# EAGLE schematic moire_v1.2 (EAGLE 9.2.0)

## Sheet 1 of 2
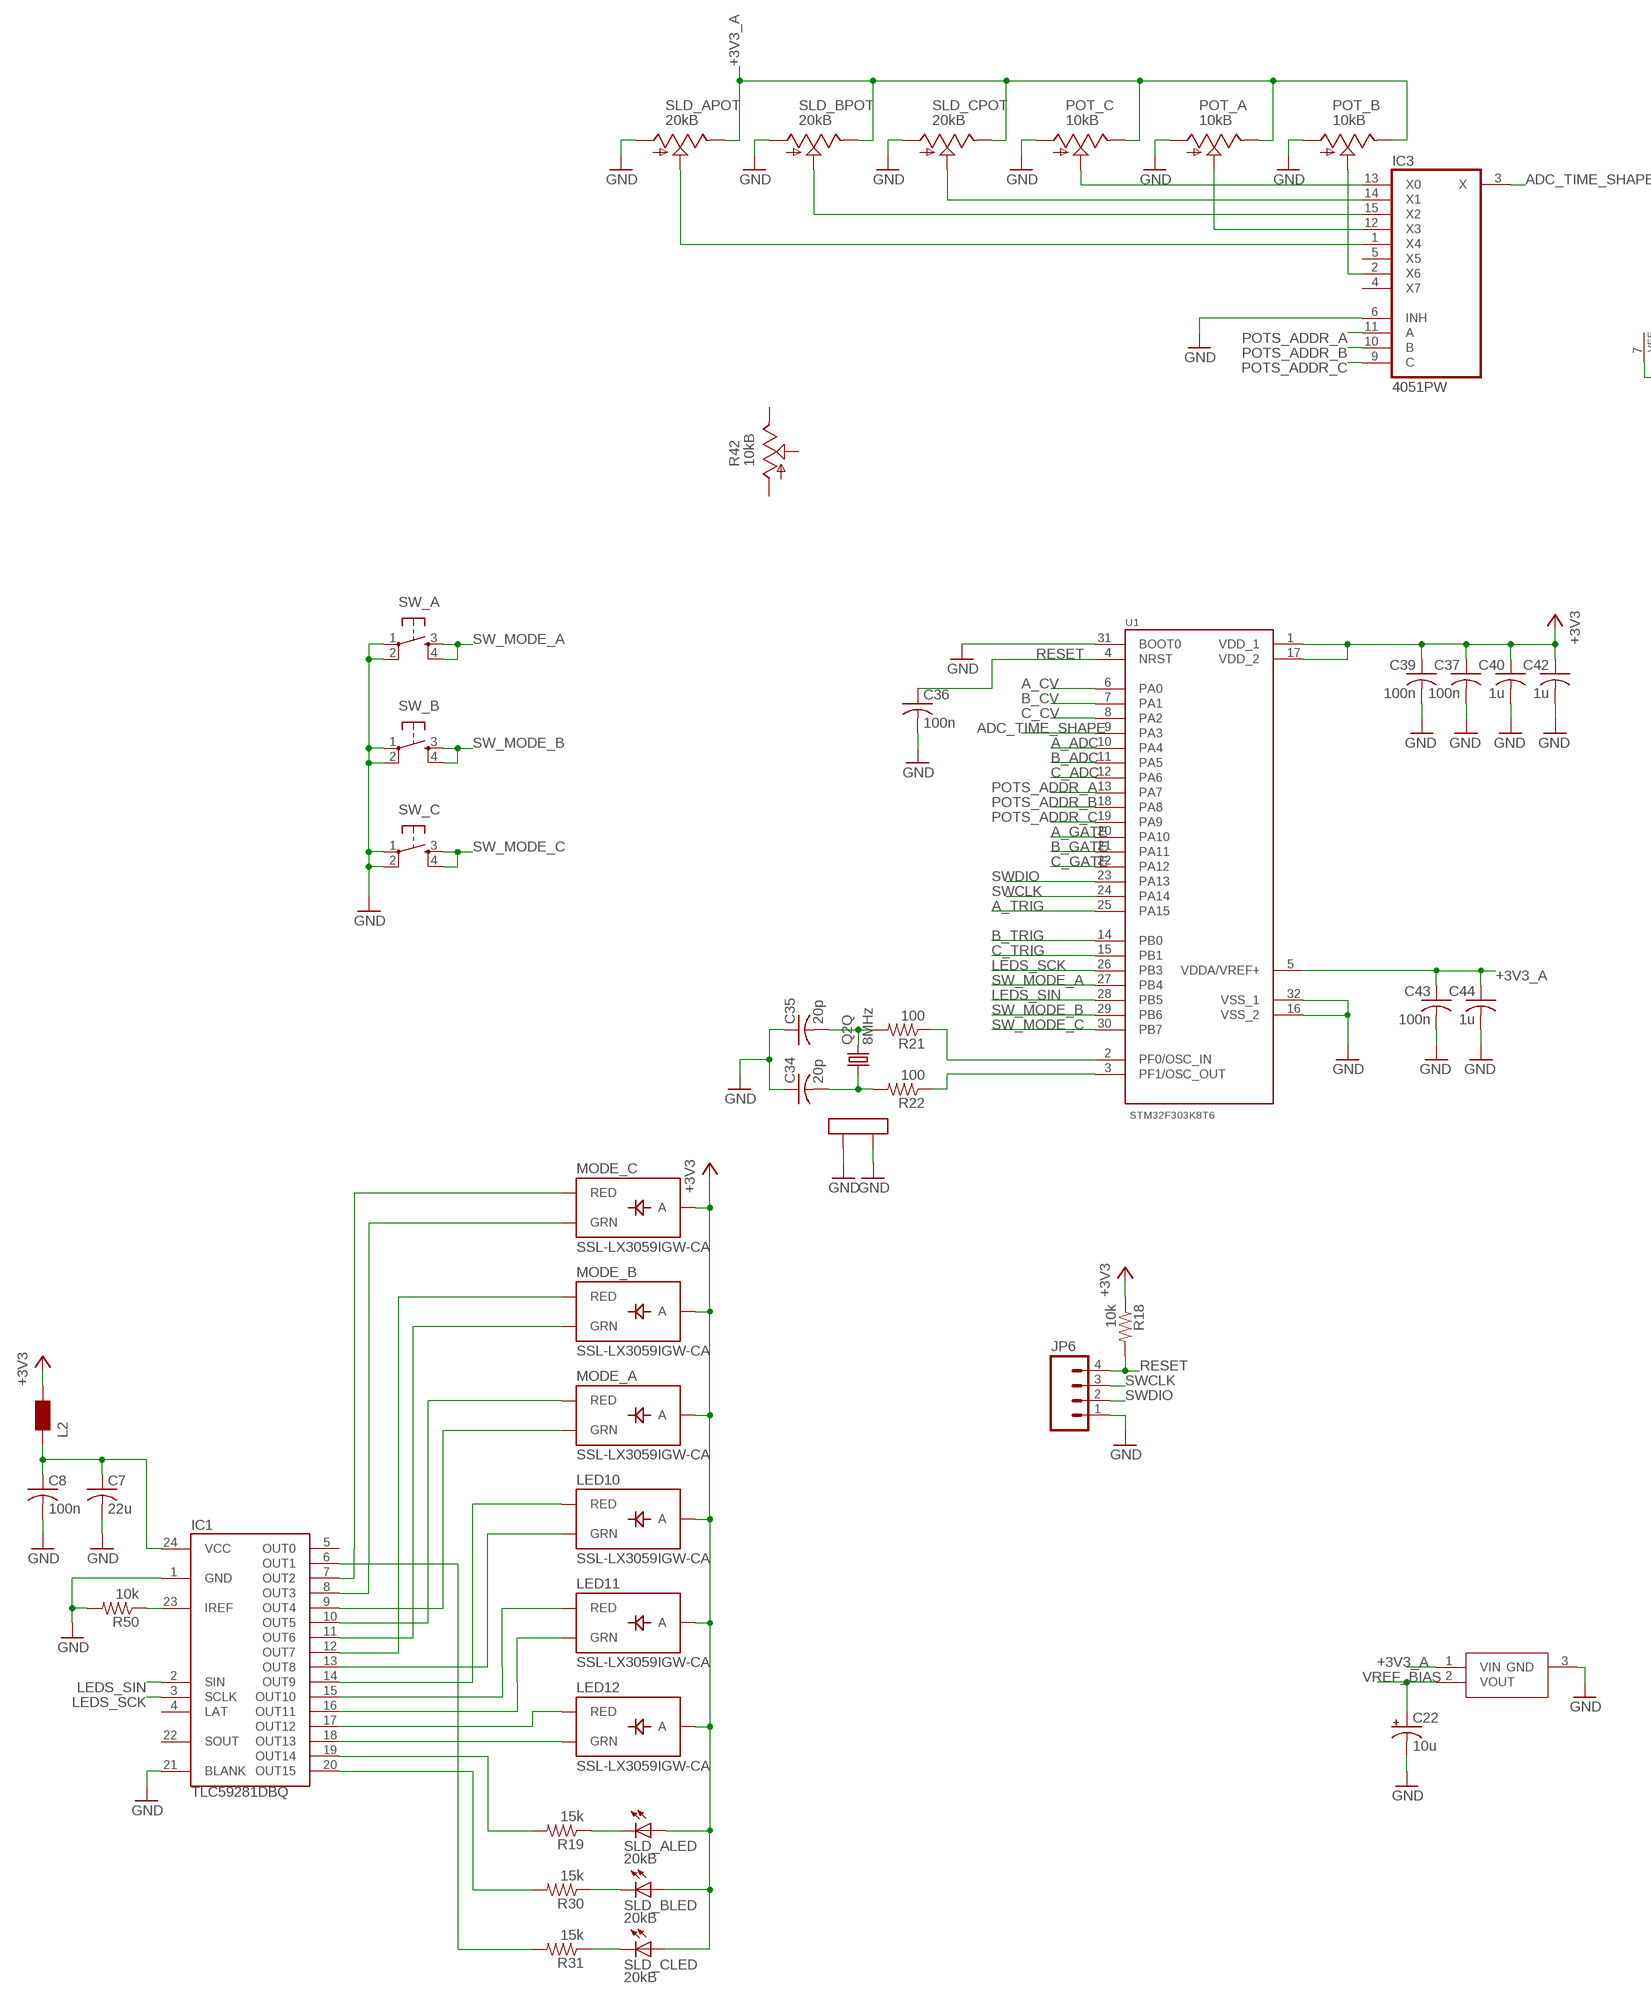
[diagram p0: schematic, sheet 1, part 1 of 2]
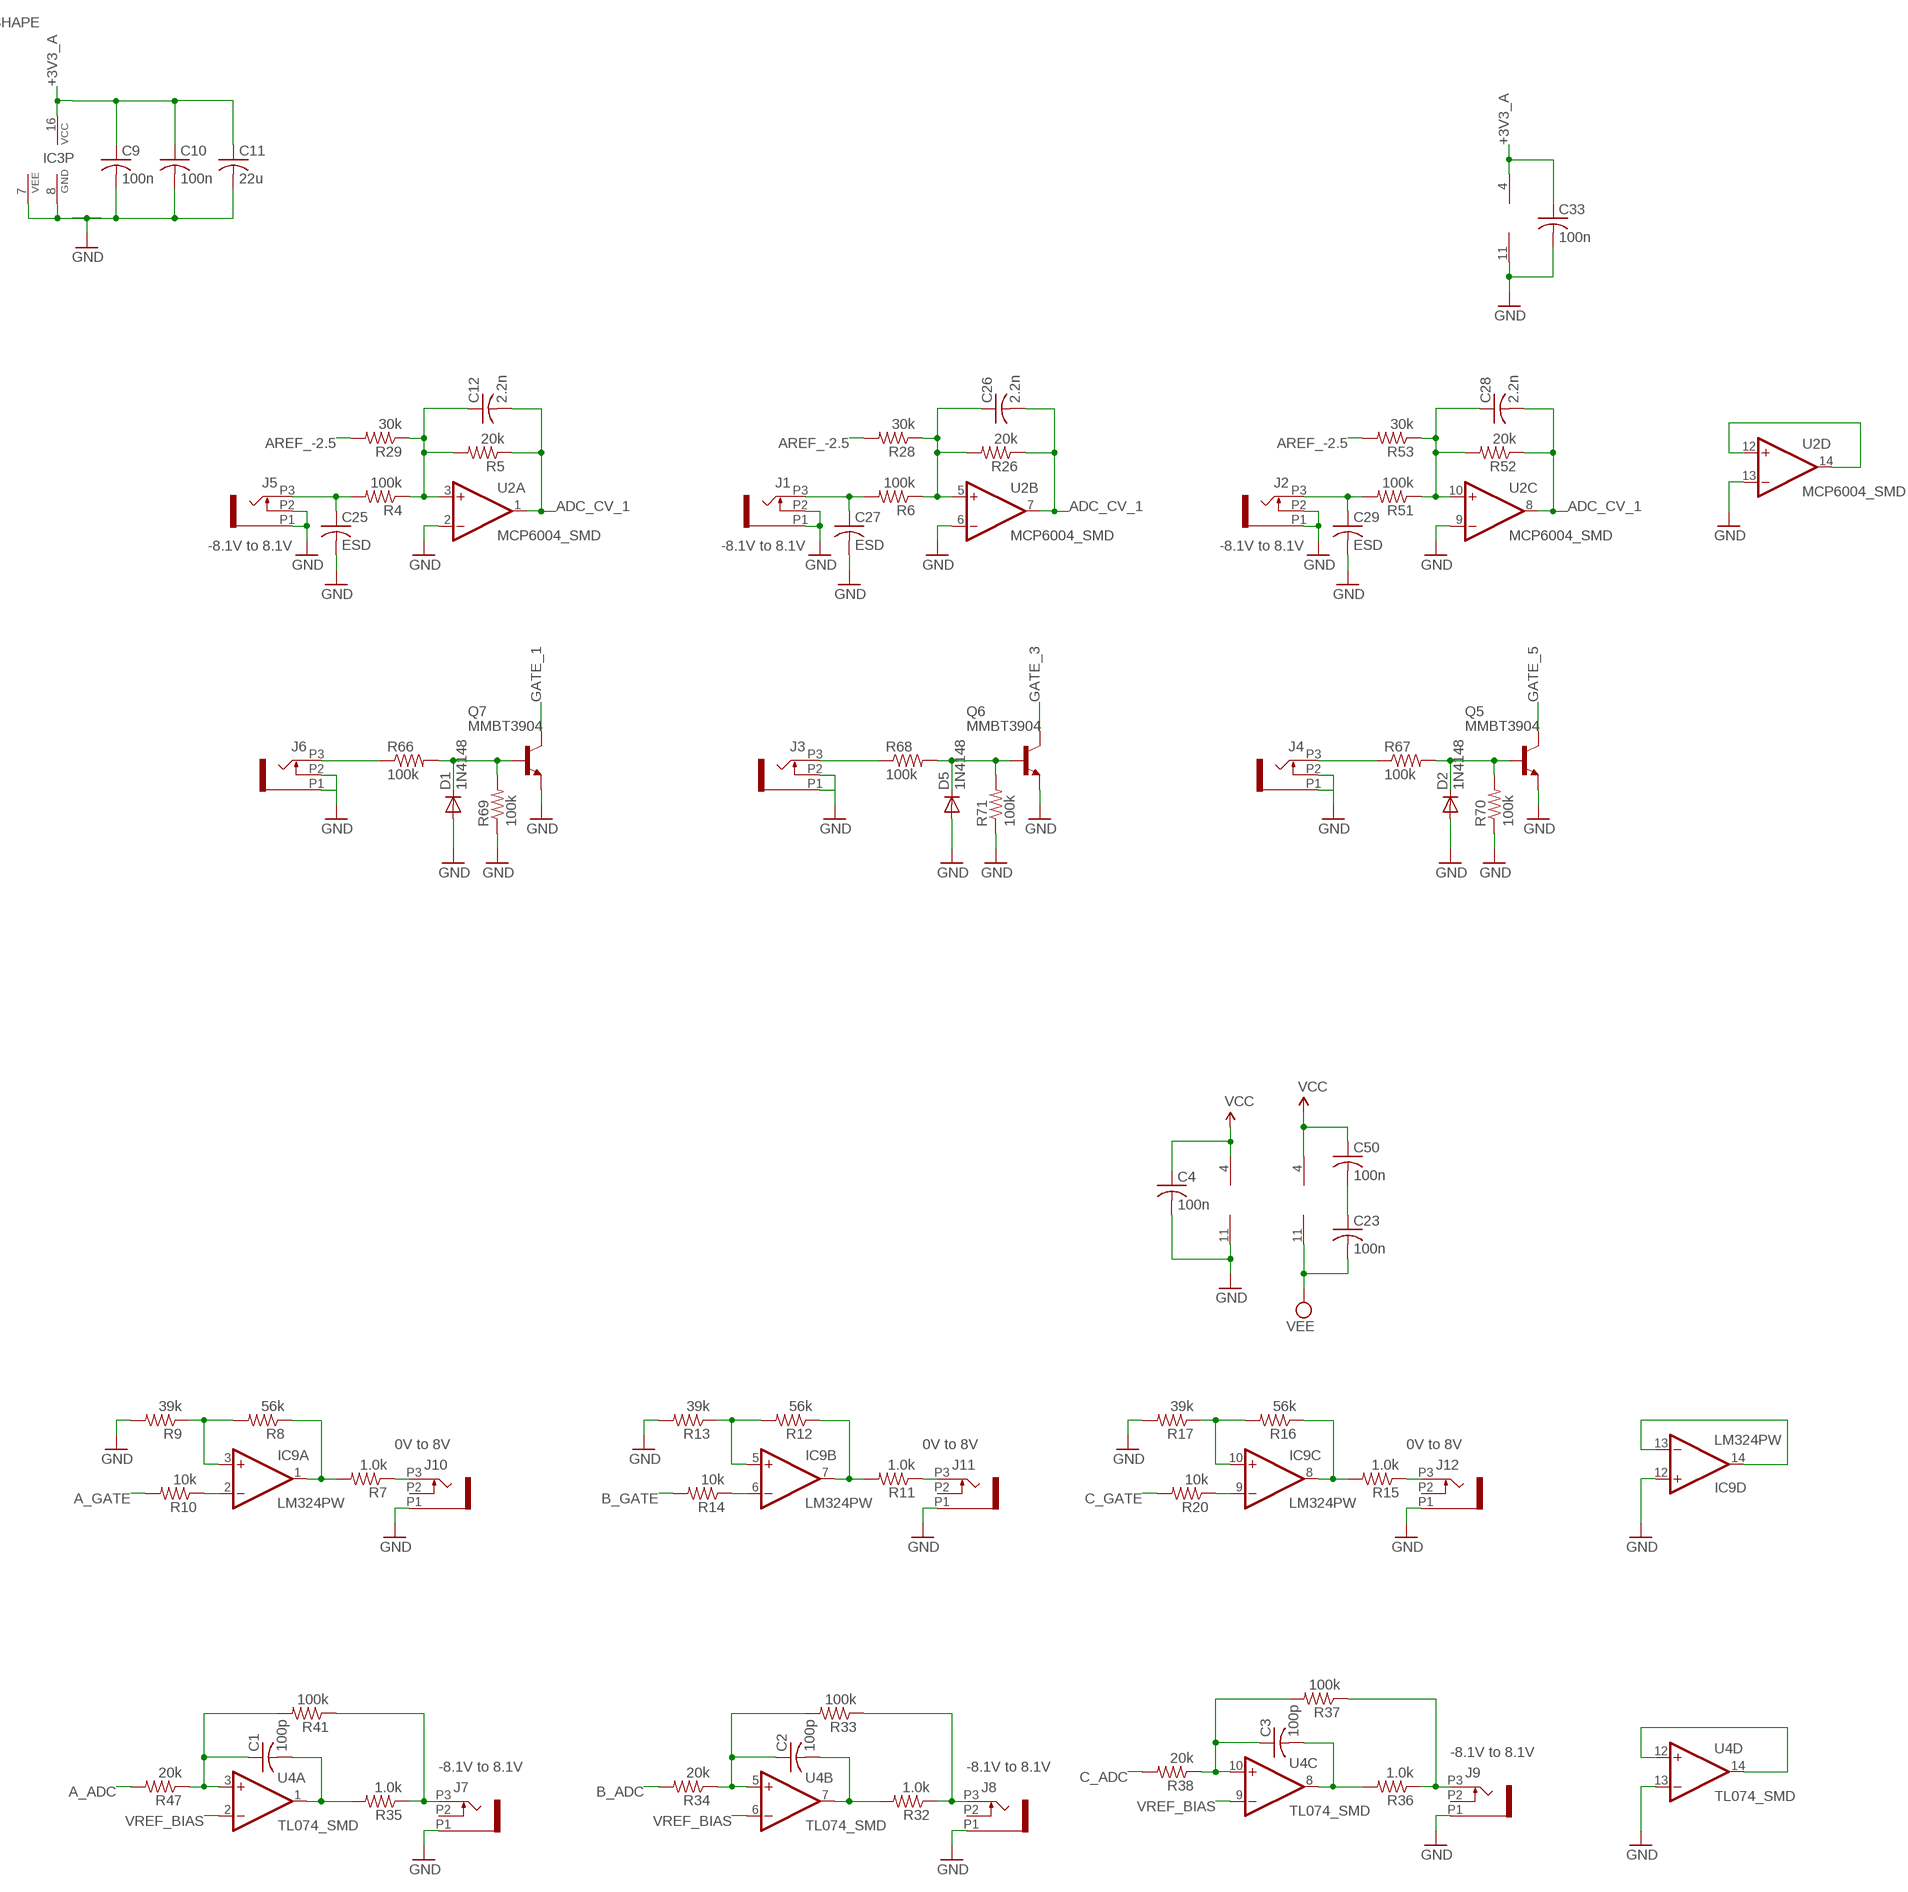
[diagram p1: schematic, sheet 1, part 2 of 2]

### Parts
C1  100p  C-USC0603  [C0603]
C2  100p  C-USC0603  [C0603]
C3  100p  C-USC0603  [C0603]
C4  100n  C-USC0402  [C0402]
C7  22u  C-USC1206  [C1206]
C8  100n  C-USC0603  [C0603]
C9  100n  C-USC0603  [C0603]
C10  100n  C-USC0603  [C0603]
C11  22u  C-USC1206  [C1206]
C12  2.2n  C-USC0402  [C0402]
C22  10u  CPOL-USA  [PANASONIC_A]
C23  100n  C-USC0603  [C0603]
C25  ESD  C-USC0603  [C0603]
C26  2.2n  C-USC0402  [C0402]
C27  ESD  C-USC0603  [C0603]
C28  2.2n  C-USC0402  [C0402]
C29  ESD  C-USC0603  [C0603]
C33  100n  C-USC0603  [C0603]
C34  20p  C-USC0603  [C0603]
C35  20p  C-USC0603  [C0603]
C36  100n  C-USC0603  [C0603]
C37  100n  C-USC0603  [C0603]
C39  100n  C-USC0603  [C0603]
C40  1u  C-USC0603  [C0603]
C42  1u  C-USC0603  [C0603]
C43  100n  C-USC0603  [C0603]
C44  1u  C-USC0603  [C0603]
C50  100n  C-USC0603  [C0603]
D1  1N4148  DIODE-SOD523  [SOD523]
D2  1N4148  DIODE-SOD523  [SOD523]
D5  1N4148  DIODE-SOD523  [SOD523]
IC1  TLC59281DBQ  [TSSOP24_0635]
IC3  4051PW  [TSSOP16_065]
IC4  LM324PW  TL074PW  [TSSOP14_065]
IC9  LM324PW  TL074PW  [TSSOP14_065]
J1  PJ301_THONKICONN6  [WQP_PJ_301M6]
J2  PJ301_THONKICONN6  [WQP_PJ_301M6]
J3  PJ301_THONKICONN6  [WQP_PJ_301M6]
J4  PJ301_THONKICONN6  [WQP_PJ_301M6]
J5  PJ301_THONKICONN6  [WQP_PJ_301M6]
J6  PJ301_THONKICONN6  [WQP_PJ_301M6]
J7  PJ301_THONKICONN6  [WQP_PJ_301M6]
J8  PJ301_THONKICONN6  [WQP_PJ_301M6]
J9  PJ301_THONKICONN6  [WQP_PJ_301M6]
J10  PJ301_THONKICONN6  [WQP_PJ_301M6]
J11  PJ301_THONKICONN6  [WQP_PJ_301M6]
J12  PJ301_THONKICONN6  [WQP_PJ_301M6]
JP6  M04PTH  [1X04]
L2  WE-CBF_0603  [0603]
LED10  SSL-LX3059IGW-CA  LED-BICOLOR-THROUGHHOLE-CA  [LED-BICOLOR-THROUGHHOLE-LUMEX]
LED11  SSL-LX3059IGW-CA  LED-BICOLOR-THROUGHHOLE-CA  [LED-BICOLOR-THROUGHHOLE-LUMEX]
LED12  SSL-LX3059IGW-CA  LED-BICOLOR-THROUGHHOLE-CA  [LED-BICOLOR-THROUGHHOLE-LUMEX]
MODE_A  SSL-LX3059IGW-CA  LED-BICOLOR-THROUGHHOLE-CA  [LED-BICOLOR-THROUGHHOLE-LUMEX]
MODE_B  SSL-LX3059IGW-CA  LED-BICOLOR-THROUGHHOLE-CA  [LED-BICOLOR-THROUGHHOLE-LUMEX]
MODE_C  SSL-LX3059IGW-CA  LED-BICOLOR-THROUGHHOLE-CA  [LED-BICOLOR-THROUGHHOLE-LUMEX]
POT_A  10kB  POT_USVERTICAL  [ALPS_POT_VERTICAL]
POT_B  10kB  POT_USVERTICAL  [ALPS_POT_VERTICAL]
POT_C  10kB  POT_USVERTICAL  [ALPS_POT_VERTICAL]
Q2  8MHz  CRYSTAL  [CTS406]
Q5  MMBT3904  MMBT3904LT1-NPN-SOT23-BEC  [SOT23-BEC]
Q6  MMBT3904  MMBT3904LT1-NPN-SOT23-BEC  [SOT23-BEC]
Q7  MMBT3904  MMBT3904LT1-NPN-SOT23-BEC  [SOT23-BEC]
R4  100k  R-US_R0603  [R0603]
R5  20k  R-US_R0603  [R0603]
R6  100k  R-US_R0603  [R0603]
R7  1.0k  R-US_R0603  [R0603]
R8  56k  R-US_R0603  [R0603]
R9  39k  R-US_R0603  [R0603]
R10  10k  R-US_R0603  [R0603]
R11  1.0k  R-US_R0603  [R0603]
R12  56k  R-US_R0603  [R0603]
R13  39k  R-US_R0603  [R0603]
R14  10k  R-US_R0603  [R0603]
R15  1.0k  R-US_R0603  [R0603]
R16  56k  R-US_R0603  [R0603]
R17  39k  R-US_R0603  [R0603]
R18  10k  R-US_R0603  [R0603]
R19  15k  R-US_R0603  [R0603]
R20  10k  R-US_R0603  [R0603]
R21  100  R-US_R0603  [R0603]
R22  100  R-US_R0603  [R0603]
R26  20k  R-US_R0603  [R0603]
R28  30k  R-US_R0603  [R0603]
R29  30k  R-US_R0603  [R0603]
R30  15k  R-US_R0603  [R0603]
R31  15k  R-US_R0603  [R0603]
R32  1.0k  R-US_R0603  [R0603]
R33  100k  R-US_R0603  [R0603]
R34  20k  R-US_R0603  [R0603]
R35  1.0k  R-US_R0603  [R0603]
R36  1.0k  R-US_R0603  [R0603]
R37  100k  R-US_R0603  [R0603]
R38  20k  R-US_R0603  [R0603]
R41  100k  R-US_R0603  [R0603]
R42  10kB  POT_USVERTICAL  [ALPS_POT_VERTICAL]
R47  20k  R-US_R0603  [R0603]
R50  10k  R-US_R0603  [R0603]
R51  100k  R-US_R0603  [R0603]
R52  20k  R-US_R0603  [R0603]
R53  30k  R-US_R0603  [R0603]
R66  100k  R-US_R0603  [R0603]
R67  100k  R-US_R0603  [R0603]
R68  100k  R-US_R0603  [R0603]
R69  100k  R-US_R0603  [R0603]
R70  100k  R-US_R0603  [R0603]
R71  100k  R-US_R0603  [R0603]
SLD_A  20kB  BOURNS_SLIDER  [BOURNS_SLIDER]
SLD_B  20kB  BOURNS_SLIDER  [BOURNS_SLIDER]
SLD_C  20kB  BOURNS_SLIDER  [BOURNS_SLIDER]
SW_A  TAC_SWITCHPTH  [TACTILE-PTH]
SW_B  TAC_SWITCHPTH  [TACTILE-PTH]
SW_C  TAC_SWITCHPTH  [TACTILE-PTH]
U1  STM32F303K8T6  [QFP80P900X900X160-32N]
U2  MCP6004_SMD  [SO14]
U4  TL074_SMD  [SO14]
U$1  ISL21010  [SOT-23-3]

### Nets
+3V3: C37.1 C39.1 C40.1 C42.1 L2.2 LED10.A LED11.A LED12.A MODE_A.A MODE_B.A MODE_C.A R18.1 SLD_A.B(LED:A) SLD_B.B(LED:A) SLD_C.B(LED:A) U1.1(VDD_1) U1.17(VDD_2) ; also sheet 2
+3V3_A: C9.1 C10.1 C11.1 C33.1 C43.1 C44.1 IC3.16(VCC) POT_A.P$1(E) POT_B.P$1(E) POT_C.P$1(E) SLD_A.3(POT:E) SLD_B.3(POT:E) SLD_C.3(POT:E) U1.5(VDDA/VREF+) U2.4(P:V+) U$1.1(VIN) ; also sheet 2
A_ADC: R47.2 U1.10(PA4)
A_CV: U1.6(PA0)
A_GATE: R10.2 U1.20(PA10)
A_TRIG: U1.25(PA15)
ADC_CV_1: C12.2 C26.2 C28.2 R5.1 R26.1 R52.1 U2.1(A:OUT) U2.7(B:OUT) U2.8(C:OUT)
ADC_TIME_SHAPE: IC3.3(X) U1.9(PA3)
AREF_-2.5: R28.2 R29.2 R53.2 ; also sheet 2
B_ADC: R34.2 U1.11(PA5)
B_CV: U1.7(PA1)
B_GATE: R14.2 U1.21(PA11)
B_TRIG: U1.14(PB0)
C_ADC: R38.2 U1.12(PA6)
C_CV: U1.8(PA2)
C_GATE: R20.2 U1.22(PA12)
C_TRIG: U1.15(PB1)
GATE_1: Q7.C
GATE_3: Q6.C
GATE_5: Q5.C
GND: C4.2 C7.2 C8.2 C9.2 C10.2 C11.2 C22.- C25.2 C27.2 C29.2 C33.2 C34.1 C35.1 C36.2 C37.2 C39.2 C40.2 C42.2 C43.2 C44.2 D1.A D2.A D5.A IC1.1(GND) IC1.21(BLANK) IC3.6(INH) IC3.7(VEE) IC3.8(GND) IC4.11(P:V-) IC9.12(D:+IN) J1.P1 J1.P2 J2.P1 J2.P2 J3.P1 J3.P2 J4.P1 J4.P2 J5.P1 J5.P2 J6.P1 J6.P2 J7.P1 J8.P1 J9.P1 J10.P1 J11.P1 J12.P1 JP6.1 POT_A.P$3(A) POT_B.P$3(A) POT_C.P$3(A) Q2.2(LID1) Q2.4(LID2) Q5.E Q6.E Q7.E R9.2 R13.2 R17.2 R50.2 R69.1 R70.1 R71.1 SLD_A.1(POT:A) SLD_B.1(POT:A) SLD_C.1(POT:A) SW_A.1 SW_A.2 SW_B.1 SW_B.2 SW_C.1 SW_C.2 U1.16(VSS_2) U1.31(BOOT0) U1.32(VSS_1) U2.2(A:-IN) U2.6(B:-IN) U2.9(C:-IN) U2.11(P:V-) U2.13(D:-IN) U4.13(D:-IN) U$1.3(GND) ; also sheet 2
LEDS_SCK: IC1.3(SCLK) U1.26(PB3)
LEDS_SIN: IC1.2(SIN) U1.28(PB5)
MORPH_IN: C25.1 J5.P3 R4.2
MORPH_IN1: C27.1 J1.P3 R6.2
MORPH_IN2: C29.1 J2.P3 R51.2
N$1: R31.1 SLD_C.E(LED:C)
N$2: J6.P3 R66.1
N$6: IC9.13(D:-IN) IC9.14(D:OUT)
N$7: J8.P3 R32.1 R33.1
N$8: C2.1 R33.2 R34.1 U4.5(B:+IN)
N$9: R21.1 U1.2(PF0/OSC_IN)
N$10: R22.1 U1.3(PF1/OSC_OUT)
N$11: C35.2 Q2.3 R21.2
N$12: C34.2 Q2.1 R22.2
N$13: U2.12(D:+IN) U2.14(D:OUT)
N$14: U4.12(D:+IN) U4.14(D:OUT)
N$16: IC9.1(A:OUT) R7.2 R8.1
N$19: C2.2 R32.2 U4.7(B:OUT)
N$20: J9.P3 R36.1 R37.1
N$21: C3.1 R37.2 R38.1 U4.10(C:+IN)
N$22: C3.2 R36.2 U4.8(C:OUT)
N$23: J10.P3 R7.1
N$24: IC9.3(A:+IN) R8.2 R9.1
N$25: IC9.2(A:-IN) R10.1
N$26: IC9.7(B:OUT) R11.2 R12.1
N$27: J11.P3 R11.1
N$28: IC9.5(B:+IN) R12.2 R13.1
N$29: IC9.6(B:-IN) R14.1
N$30: IC9.8(C:OUT) R15.2 R16.1
N$31: J12.P3 R15.1
N$32: IC1.11(OUT6) MODE_B.GREEN_C(GRN)
N$33: IC1.10(OUT5) MODE_A.RED_C(RED)
N$34: IC1.12(OUT7) MODE_B.RED_C(RED)
N$35: IC1.7(OUT2) MODE_C.RED_C(RED)
N$36: IC1.8(OUT3) MODE_C.GREEN_C(GRN)
N$37: IC1.15(OUT10) LED11.RED_C(RED)
N$38: IC1.16(OUT11) LED11.GREEN_C(GRN)
N$39: IC1.13(OUT8) LED10.GREEN_C(GRN)
N$40: IC1.17(OUT12) LED12.RED_C(RED)
N$41: D1.C Q7.B R66.2 R69.2
N$42: IC1.18(OUT13) LED12.GREEN_C(GRN)
N$43: IC1.14(OUT9) LED10.RED_C(RED)
N$44: C7.1 C8.1 IC1.24(VCC) L2.1
N$45: IC1.19(OUT14) R19.2
N$46: IC1.20(OUT15) R30.2
N$47: IC1.6(OUT1) R31.2
N$48: IC3.1(X4) SLD_A.2(POT:S)
N$49: R30.1 SLD_B.E(LED:C)
N$50: R19.1 SLD_A.E(LED:C)
N$51: IC3.2(X6) POT_B.P$2(S)
N$52: C23.1 C50.2
N$53: IC3.12(X3) POT_A.P$2(S)
N$54: IC3.13(X0) POT_C.P$2(S)
N$55: IC3.14(X1) SLD_C.2(POT:S)
N$56: IC3.15(X2) SLD_B.2(POT:S)
N$57: C12.1 R4.1 R5.2 R29.1 U2.3(A:+IN)
N$58: C26.1 R6.1 R26.2 R28.1 U2.5(B:+IN)
N$59: C28.1 R51.1 R52.2 R53.1 U2.10(C:+IN)
N$60: J3.P3 R68.1
N$61: IC9.10(C:+IN) R16.2 R17.1
N$62: D5.C Q6.B R68.2 R71.2
N$63: J4.P3 R67.1
N$64: IC9.9(C:-IN) R20.1
N$65: D2.C Q5.B R67.2 R70.2
N$68: IC1.23(IREF) R50.1
N$86: J7.P3 R35.1 R41.1
N$87: C1.1 R41.2 R47.1 U4.3(A:+IN)
N$93: C1.2 R35.2 U4.1(A:OUT)
N$101: IC1.9(OUT4) MODE_A.GREEN_C(GRN)
POTS_ADDR_A: IC3.11(A) U1.13(PA7)
POTS_ADDR_B: IC3.10(B) U1.18(PA8)
POTS_ADDR_C: IC3.9(C) U1.19(PA9)
RESET: C36.1 JP6.4 R18.2 U1.4(NRST)
SW_MODE_A: SW_A.3 SW_A.4 U1.27(PB4)
SW_MODE_B: SW_B.3 SW_B.4 U1.29(PB6)
SW_MODE_C: SW_C.3 SW_C.4 U1.30(PB7)
SWCLK: JP6.3 U1.24(PA14)
SWDIO: JP6.2 U1.23(PA13)
VCC: C4.1 C50.1 IC4.4(P:V+) U4.4(P:V+) ; also sheet 2
VEE: C23.2 U4.11(P:V-) ; also sheet 2
VREF_BIAS: C22.+ U4.2(A:-IN) U4.6(B:-IN) U4.9(C:-IN) U$1.2(VOUT)
Unconnected: IC1.4(LAT) IC1.5(OUT0) IC1.22(SOUT) IC3.4(X7) IC3.5(X5) IC4.1(A:OUT) IC4.2(A:-IN) IC4.3(A:+IN) IC4.5(B:+IN) IC4.6(B:-IN) IC4.7(B:OUT) IC4.8(C:OUT) IC4.9(C:-IN) IC4.10(C:+IN) IC4.12(D:+IN) IC4.13(D:-IN) IC4.14(D:OUT) J7.P2 J8.P2 J9.P2 J10.P2 J11.P2 J12.P2 R42.P$1(E) R42.P$2(S) R42.P$3(A)

### Notes on the sheet
- -8.1V to 8.1V | -8.1V to 8.1V | -8.1V to 8.1V
- 0V to 8V | 0V to 8V | 0V to 8V
- -8.1V to 8.1V
- -8.1V to 8.1V | -8.1V to 8.1V

## Sheet 2 of 2
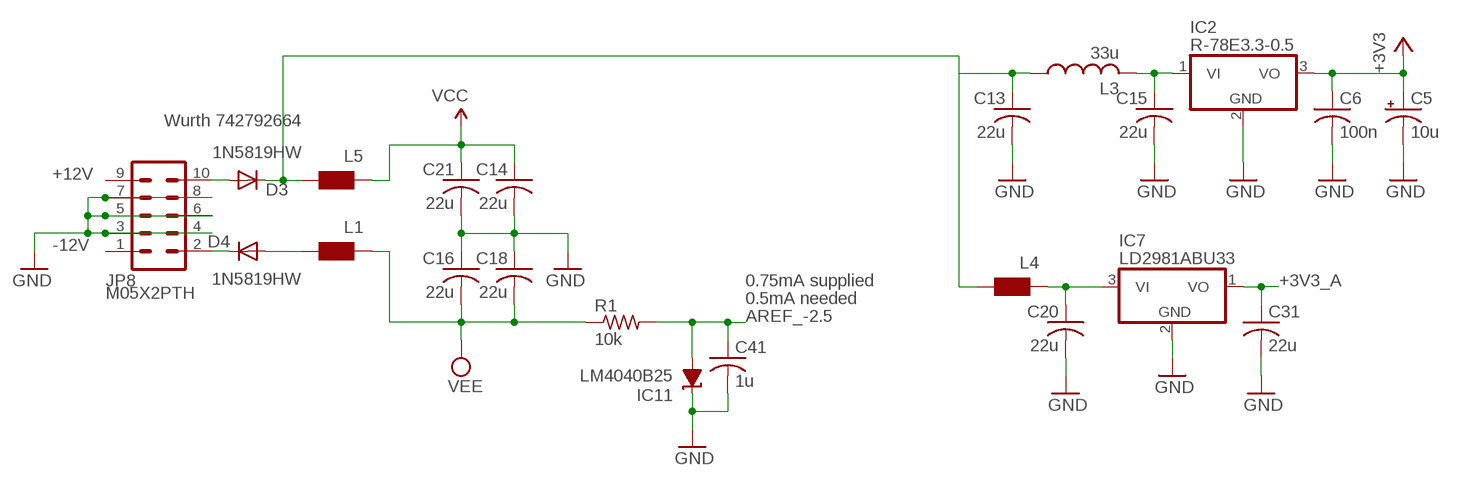
[diagram p2: schematic, sheet 2]

### Parts
C5  10u  CPOL-USA  [PANASONIC_A]
C6  100n  C-USC0402  [C0402]
C13  22u  C-USC1206  [C1206]
C14  22u  C-USC1206  [C1206]
C15  22u  C-USC1206  [C1206]
C16  22u  C-USC1206  [C1206]
C18  22u  C-USC1206  [C1206]
C20  22u  C-USC1206  [C1206]
C21  22u  C-USC1206  [C1206]
C31  22u  C-USC1206  [C1206]
C41  1u  C-USC0402  [C0402]
D3  1N5819HW  DIODE-SOD123  [SOD123]
D4  1N5819HW  DIODE-SOD123  [SOD123]
IC2  R-78E3.3-0.5  WE173950378  [WE78]
IC7  LD2981ABU33  LD2981ABU  [SOT89]
IC11  LM4040B25  LM4041B12DBZ  [DBZ_R-PDSO-G3]
JP8  M05X2PTH  [2X5-PTH]
L1  WE-CBF_0603  [0603]
L3  33u  L-USL2012C  [L2012C]
L4  WE-CBF_0603  [0603]
L5  WE-CBF_0603  [0603]
R1  10k  R-US_R0603  [R0603]

### Nets
+3V3: C5.+ C6.1 IC2.3(VO) ; also sheet 1
+3V3_A: C31.1 IC7.1(VO) ; also sheet 1
+12V: D3.A JP8.10
-12V: D4.C JP8.2
AREF_-2.5: C41.1 IC11.2(A) R1.2 ; also sheet 1
GND: C5.- C6.2 C13.2 C14.2 C15.2 C16.1 C18.1 C20.2 C21.2 C31.2 C41.2 IC2.2(GND) IC7.2(GND) IC11.1(C) JP8.3 JP8.4 JP8.5 JP8.6 JP8.7 JP8.8 ; also sheet 1
N$3: D4.A L1.2
N$4: D3.C L4.2 L5.2
N$5: C20.1 IC7.3(VI) L4.1
N$15: JP8.9
N$17: JP8.1
N$66: C15.1 IC2.1(VI) L3.2
N$67: C13.1 L3.1
VCC: C14.1 C21.1 L5.1 ; also sheet 1
VEE: C16.2 C18.2 L1.1 R1.1 ; also sheet 1

### Notes on the sheet
- Wurth 742792664
- 0.75mA supplied
- 0.5mA needed

## Power pins joined to a net without a drawn wire
V+: IC9.4(P:V+)
V-: IC9.11(P:V-)

## Library data of the parts
C1-C4 C6-C16 C18 C20 C21 C23 C25-C29 C31 C33-C37 C39-C44 C50 = rcl:C-US: CAPACITOR, American symbol
C5 C22 = rcl:CPOL-US: POLARIZED CAPACITOR, American symbol
D1-D5 = diode:DIODE-: DIODE
IC1 = og-ics:TLC59281
IC2 = og-vreg:WE173950378
IC3 = og-ics:4051: 8-channel ANALOG MULTIPLEXER
IC4 IC9 = og-linear:TL074: OP AMP
IC7 = og-vreg:LD2981
IC11 = texas:LM4041: PRECISION MICROPOWER SHUNT VOLTAGE REFERENCE Source: http://focus.ti.com/lit/ds/slcs146e/slcs146e.pdf
J1-J12 = og-pj301_variations:PJ301_THONKICONN
JP6 = SparkFun:M04: Header 4 Standard 4-pin 0.1" header. Use with straight break away headers (SKU : PRT-00116), right angle break away headers (PRT-00553), swiss pins (PRT-00743), machine pins (PRT-00117), and female headers (PRT-00115). Molex polarized connector foot print use with SKU : PRT-08231 with associated crimp pins and housings.
JP8 = og-header:M05X2: Header 5x2 Standard 10-pin dual row 0.1" header. Commonly used with AVR-ISP. Use with Spark Fun Electronics SKU: PRT-00778
L1 L2 L4 L5 = wuerth-elektronik:WE-CBF: SMD EMI Suppression Ferrite Beads - excellent anti-EMI properties - low DCR - impedances till 3000 ohms - rated current up to 6 A
L3 = og-rcl:L-US
LED10-LED12 MODE_A MODE_B MODE_C = og-leds:LED-BICOLOR-THROUGHHOLE-CA
POT_A POT_B POT_C R42 = og-pots:POT_US
Q2 = og-crystal:CRYSTAL: Crystal with 2 extra terminals for the metal LID (Abracon ABMM2 for example)
Q5-Q7 = transistor:*-NPN-: NPN Transistror BF959 corrected 2008.03.06
R1 R4-R22 R26 R28-R38 R41 R47 R50-R53 R66-R71 = rcl:R-US_: RESISTOR, American symbol
SLD_A SLD_B SLD_C = og-pots:BOURNS_SLIDER
SW_A SW_B SW_C = SparkFun:TAC_SWITCH: Momentary Switch Button commonly used for reset or general input. Spark Fun Electronics SKU : COM-00097
U1 = STM32F303K8T6:STM32F303K8T6: Analog and DSP with FPU ARM Cortex-M4 MCU with 64 Kbytes Flash, 72 MHz CPU, CCM, 12-bit ADC 5 MSPS, comparators, op-amp; AVAILABILITY: Unavailable; DESCRIPTION: Analog and DSP with FPU ARM Cortex-M4 MCU with 64 Kbytes Flash, 72 MHz CPU, CCM, 12-bit ADC 5 MSPS, comparators, op-amp; MF: STMicroelectronics; MP: STM32F303K8T6; PACKAGE: LQFP-32 STMicroelectronics; PRICE: None
U2 = MusicThingModular:MCP6004: Generic Quad Op Amp
U4 = MusicThingModular:TL074: Generic Quad Op Amp
U$1 = ISL21010CFH315Z-TK:ISL21010